# Altium schematic sheet Sheet_1_2024-04-10.schdoc
size 400 x 268 mm
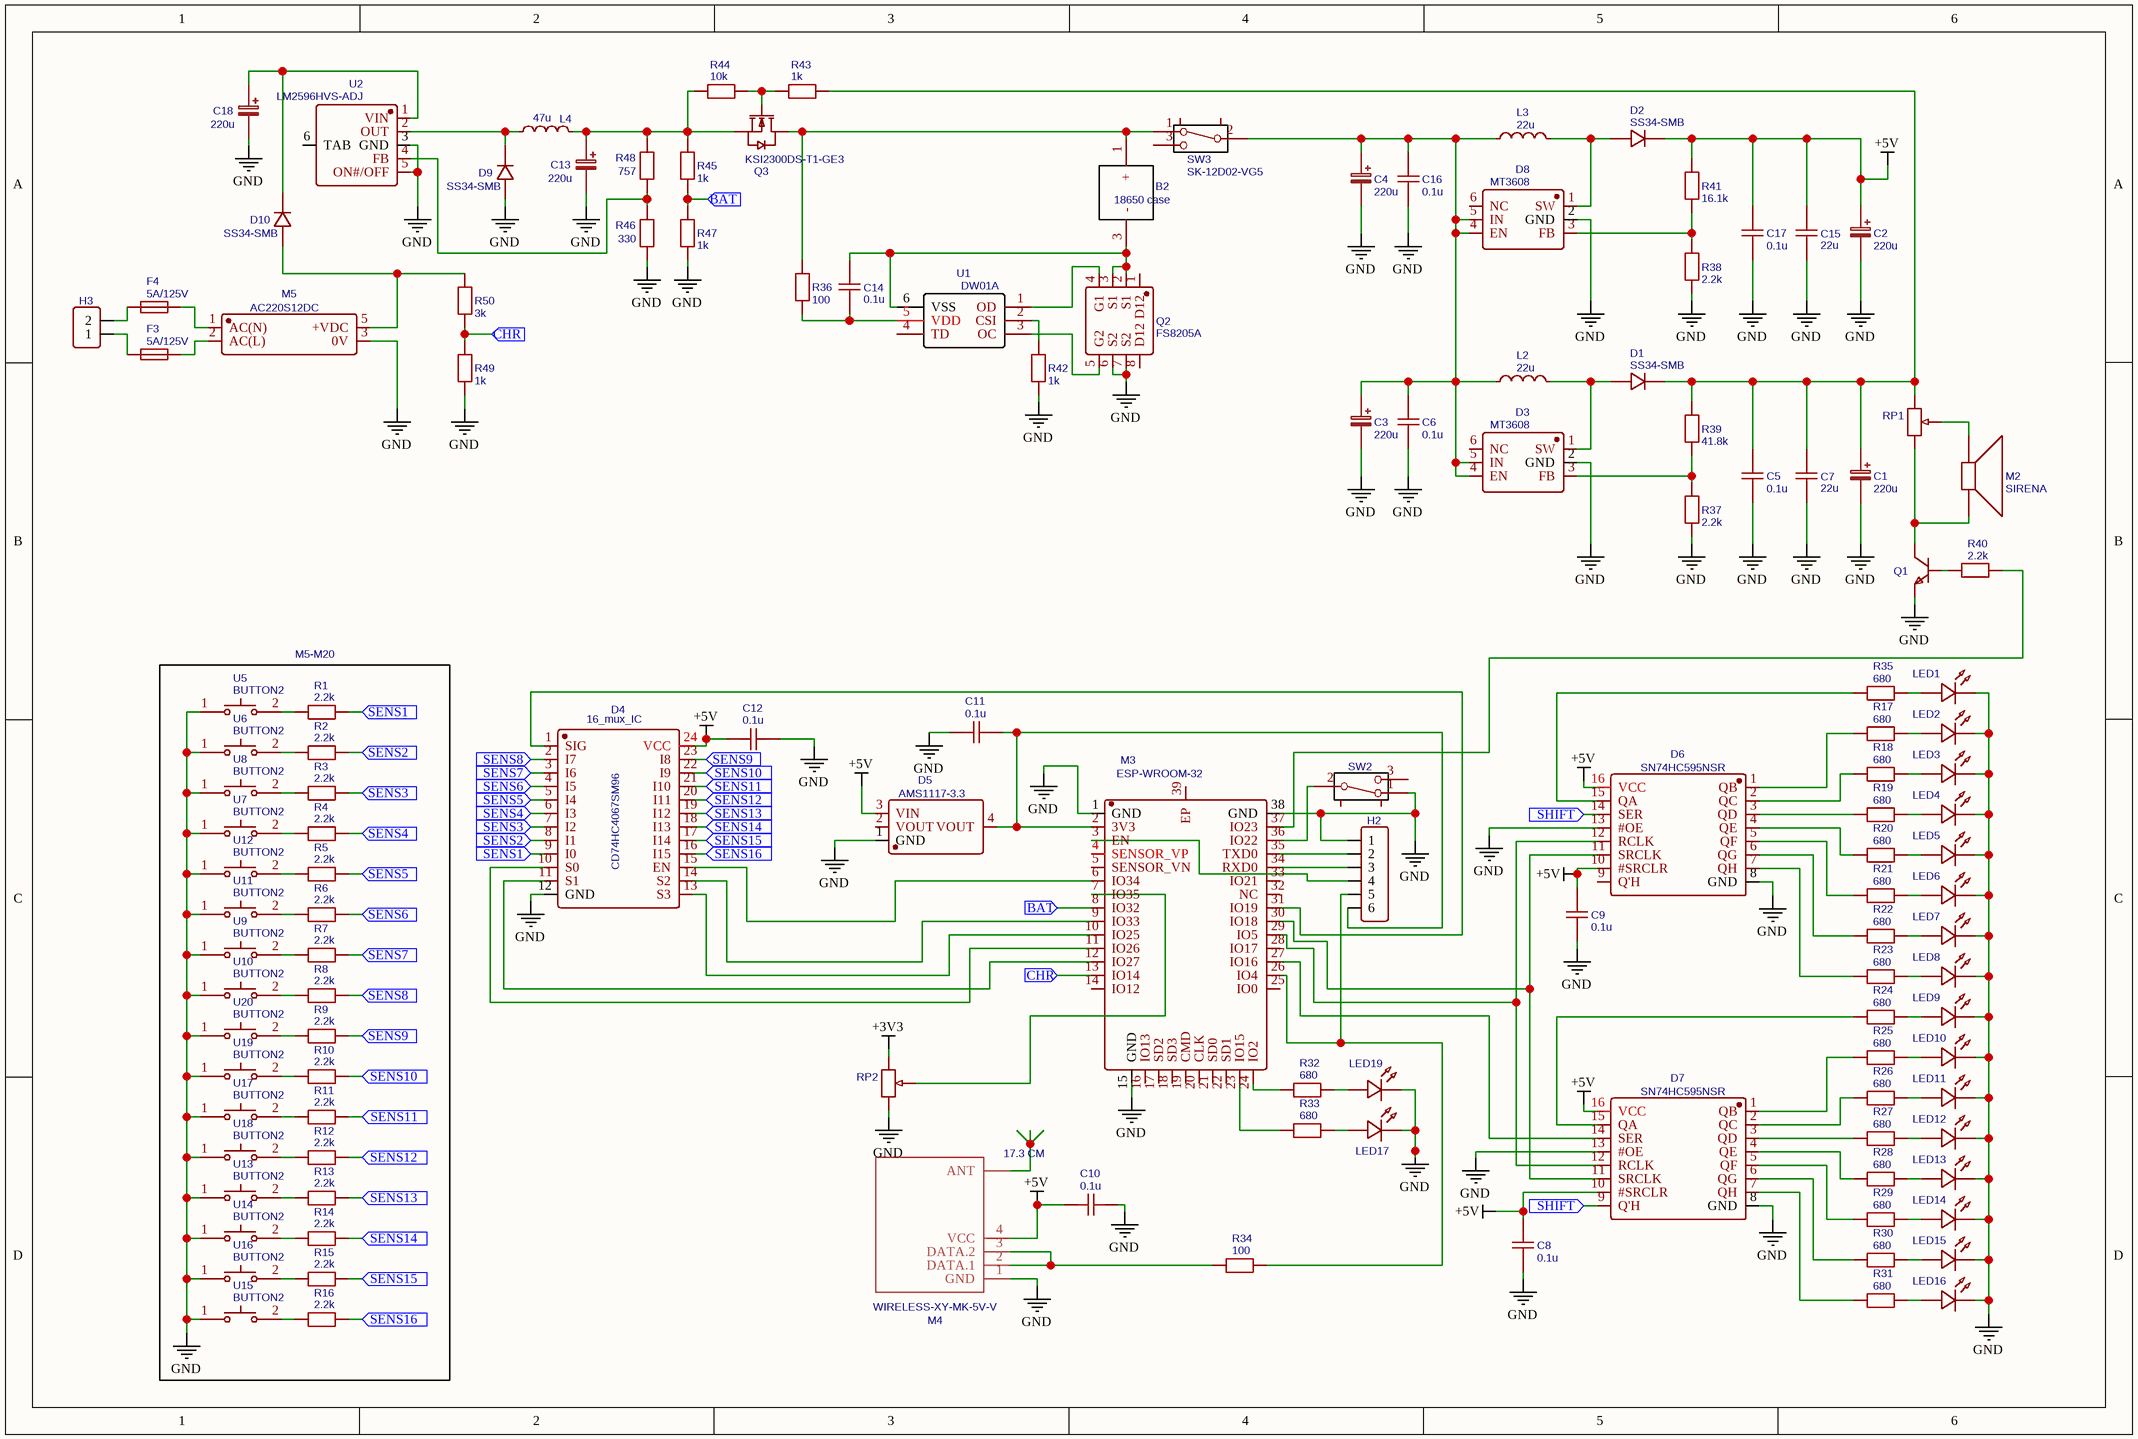
[diagram p0: Sheet_1_2024-04-10.schdoc]

## Parts
B2  18650 case  [MY-18650-02_18650]
C1  220u  [CAP-D8.0×H10.5]
C2  220u  [CAP-D8.0×H10.5]
C3  220u  [CAP-D8.0×H10.5]
C4  220u  [CAP-D8.0×H10.5]
C5  0.1u  [C0603]
C6  0.1u  [C0603]
C7  22u  [C0603]
C8  0.1u  [C0603]
C9  0.1u  [C0603]
C10  0.1u  [C0603]
C11  0.1u  [C0603]
C12  0.1u  [C0603]
C13  220u  [CAP-D8.0×H10.5]
C14  0.1u  [C0603]
C15  22u  [C0603]
C16  0.1u  [C0603]
C17  0.1u  [C0603]
C18  220u  [CAP-D8.0×H10.5]
D1  SS34-SMB  [SMB_L4.4-W3.6-LS5.3-RD]
D2  SS34-SMB  [SMB_L4.4-W3.6-LS5.3-RD]
D3  MT3608  [SOT-23-6_L2.9-W1.6-P0.95-LS2.8-BL]
D4  16_mux_IC  [HP4067]
D5  AMS1117-3.3  [SOT-223-3_L6.5-W3.4-P2.30-LS7.0-BR]
D6  SN74HC595NSR  [SOP-16_L10.3-W5.4-P1.27-LS7.8-BL]
D7  SN74HC595NSR  [SOP-16_L10.3-W5.4-P1.27-LS7.8-BL]
D8  MT3608  [SOT-23-6_L2.9-W1.6-P0.95-LS2.8-BL]
D9  SS34-SMB  [SMB_L4.4-W3.6-LS5.3-RD]
D10  SS34-SMB  [SMB_L4.4-W3.6-LS5.3-RD]
F3  5A/125V  [FUSE-SMD_L6.1-W2.5]
F4  5A/125V  [FUSE-SMD_L6.1-W2.5]
H2  HDR-F-2.54_1x6  [HDR-F-2.54_1X6]  (value not drawn)
H3  HDR-F-2.54_1x2  [HDR-F-2.54_1X2]  (value not drawn)
L2  22u  [L_AXIAL-0.6]
L3  22u  [L_AXIAL-0.6]
L4  47u  [L_AXIAL-0.6]
LED1  LED-TH-5mm_R  [LED-TH_BD5.0_RED]  (value not drawn)
LED2  LED-TH-5mm_R  [LED-TH_BD5.0_RED]  (value not drawn)
LED3  LED-TH-5mm_R  [LED-TH_BD5.0_RED]  (value not drawn)
LED4  LED-TH-5mm_R  [LED-TH_BD5.0_RED]  (value not drawn)
LED5  LED-TH-5mm_R  [LED-TH_BD5.0_RED]  (value not drawn)
LED6  LED-TH-5mm_R  [LED-TH_BD5.0_RED]  (value not drawn)
LED7  LED-TH-5mm_R  [LED-TH_BD5.0_RED]  (value not drawn)
LED8  LED-TH-5mm_R  [LED-TH_BD5.0_RED]  (value not drawn)
LED9  LED-TH-5mm_R  [LED-TH_BD5.0_RED]  (value not drawn)
LED10  LED-TH-5mm_R  [LED-TH_BD5.0_RED]  (value not drawn)
LED11  LED-TH-5mm_R  [LED-TH_BD5.0_RED]  (value not drawn)
LED12  LED-TH-5mm_R  [LED-TH_BD5.0_RED]  (value not drawn)
LED13  LED-TH-5mm_R  [LED-TH_BD5.0_RED]  (value not drawn)
LED14  LED-TH-5mm_R  [LED-TH_BD5.0_RED]  (value not drawn)
LED15  LED-TH-5mm_R  [LED-TH_BD5.0_RED]  (value not drawn)
LED16  LED-TH-5mm_R  [LED-TH_BD5.0_RED]  (value not drawn)
LED17  LED-TH-5mm_G  [LED-TH_BD5.0_GREEN]  (value not drawn)
LED19  LED-TH-5mm_B  [LED-TH_BD5.0_BLUE]  (value not drawn)
M2  SIRENA  [CONN-TH_2P-P5.08]
M3  ESP-WROOM-32  [WIFIM-SMD_ESP-WROOM-32]
M4  WIRELESS-XY-MK-5V-V  [WIRELESS-XY-MK-5V#V]
M5  AC220S12DC  [PWRM-TH_AC220S12DC]
Q1  2N3904(SOT-23)  [SOT-23-3_L2.9-W1.3-P1.90-LS2.4-TR]  (value not drawn)
Q2  FS8205A  [TSSOP-8_L4.4-W3.0-P0.65-LS6.4-BL-2]
Q3  KSI2300DS-T1-GE3  [SOT-23-3_L2.9-W1.3-P1.90-LS2.4-BR]
R1  2.2k  [R_AXIAL-0.8]
R2  2.2k  [R_AXIAL-0.8]
R3  2.2k  [R_AXIAL-0.8]
R4  2.2k  [R_AXIAL-0.8]
R5  2.2k  [R_AXIAL-0.8]
R6  2.2k  [R_AXIAL-0.8]
R7  2.2k  [R_AXIAL-0.8]
R8  2.2k  [R_AXIAL-0.8]
R9  2.2k  [R_AXIAL-0.8]
R10  2.2k  [R_AXIAL-0.8]
R11  2.2k  [R_AXIAL-0.8]
R12  2.2k  [R_AXIAL-0.8]
R13  2.2k  [R_AXIAL-0.8]
R14  2.2k  [R_AXIAL-0.8]
R15  2.2k  [R_AXIAL-0.8]
R16  2.2k  [R_AXIAL-0.8]
R17  680  [R1206]
R18  680  [R1206]
R19  680  [R1206]
R20  680  [R1206]
R21  680  [R1206]
R22  680  [R1206]
R23  680  [R1206]
R24  680  [R1206]
R25  680  [R1206]
R26  680  [R1206]
R27  680  [R1206]
R28  680  [R1206]
R29  680  [R1206]
R30  680  [R1206]
R31  680  [R1206]
R32  680  [R1206]
R33  680  [R1206]
R34  100  [R1206]
R35  680  [R1206]
R36  100  [R1206]
R37  2.2k  [R1206]
R38  2.2k  [R1206]
R39  41.8k  [R1206]
R40  2.2k  [R1206]
R41  16.1k  [R1206]
R42  1k  [R1206]
R43  1k  [R1206]
R44  10k  [R1206]
R45  1k  [R1206]
R46  330  [R1206]
R47  1k  [R1206]
R48  757  [R1206]
R49  1k  [R1206]
R50  3k  [R1206]
RP1  R_3386P_EU  [RES-ADJ-TH_3386P]  (value not drawn)
RP2  R_3386P_EU  [RES-ADJ-TH_3386P]  (value not drawn)
SW2  SK-12D02-VG5  [SW-TH_SK-12D02VG3]  (value not drawn)
SW3  SK-12D02-VG5  [SW-TH_SK-12D02VG3]
U1  DW01A  [SOT-23-6_L2.9-W1.6-P0.95-LS2.8-BL]
U2  LM2596HVS-ADJ  [TO-263-5_L10.0-W8.4-P1.70-LS15.3-BR]
U5  BUTTON2  [SW-SMD_L6.0-W3.5-LS8.0-1]
U6  BUTTON2  [SW-SMD_L6.0-W3.5-LS8.0-1]
U7  BUTTON2  [SW-SMD_L6.0-W3.5-LS8.0-1]
U8  BUTTON2  [SW-SMD_L6.0-W3.5-LS8.0-1]
U9  BUTTON2  [SW-SMD_L6.0-W3.5-LS8.0-1]
U10  BUTTON2  [SW-SMD_L6.0-W3.5-LS8.0-1]
U11  BUTTON2  [SW-SMD_L6.0-W3.5-LS8.0-1]
U12  BUTTON2  [SW-SMD_L6.0-W3.5-LS8.0-1]
U13  BUTTON2  [SW-SMD_L6.0-W3.5-LS8.0-1]
U14  BUTTON2  [SW-SMD_L6.0-W3.5-LS8.0-1]
U15  BUTTON2  [SW-SMD_L6.0-W3.5-LS8.0-1]
U16  BUTTON2  [SW-SMD_L6.0-W3.5-LS8.0-1]
U17  BUTTON2  [SW-SMD_L6.0-W3.5-LS8.0-1]
U18  BUTTON2  [SW-SMD_L6.0-W3.5-LS8.0-1]
U19  BUTTON2  [SW-SMD_L6.0-W3.5-LS8.0-1]
U20  BUTTON2  [SW-SMD_L6.0-W3.5-LS8.0-1]

## Blocks framed on the sheet
M5-M20: R1-R16 U5-U20

## Ports
BAT (in), CHR (in), SENS1 (in), SENS2 (in), SENS3 (in), SENS4 (in), SENS5 (in), SENS6 (in), SENS7 (in), SENS8 (in), SENS9 (in), SENS10 (in), SENS11 (in), SENS12 (in), SENS13 (in), SENS14 (in), SENS15 (in), SENS16 (in), SHIFT (in)

## Nets
+3V3: RP2.1
+5V: C2.1 C8.2 C9.2 C10.2 C12.2 C15.1 C17.2 D2.1(C) D4.24(VCC) D5.3(VIN) D6.10(#SRCLR) D6.16(VCC) D7.10(#SRCLR) D7.16(VCC) M4.4(VCC) R41.2
GND: C1.2 C2.2 C3.2 C4.2 C5.1 C6.1 C7.2 C8.1 C9.1 C10.1 C11.2 C12.1 C13.2 C15.2 C16.1 C17.1 C18.2 D3.2(GND) D4.12(GND) D5.1(GND) D6.8(GND) D6.13(#OE) D7.8(GND) D7.13(#OE) D8.2(GND) D9.2(A) H2.1 LED1.2 LED2.2 LED3.2 LED4.2 LED5.2 LED6.2 LED7.2 LED8.2 LED9.2 LED10.2 LED11.2 LED12.2 LED13.2 LED14.2 LED15.2 LED16.2 LED17.2 LED19.2 M3.1(GND) M3.15(GND) M3.38(GND) M4.1(GND) M5.3(0V) Q1.1(E) Q2.6(S2) Q2.7(S2) R37.1 R38.1 R42.1 R46.2 R47.2 R49.2 RP2.3 SW2.1 U2.3(GND) U2.5(ON#/OFF) U5.1 U6.1 U7.1 U8.1 U9.1 U10.1 U11.1 U12.1 U13.1 U14.1 U15.1 U16.1 U17.1 U18.1 U19.1 U20.1
BAT: M3.8(IO32) R45.2 R47.1 ; port BAT
CHR: M3.13(IO14) R49.1 R50.2 ; port CHR
SENS1: D4.9(I0) R1.2 ; port SENS1
SENS2: D4.8(I1) R2.2 ; port SENS2
SENS3: D4.7(I2) R3.2 ; port SENS3
SENS4: D4.6(I3) R4.2 ; port SENS4
SENS5: D4.5(I4) R5.2 ; port SENS5
SENS6: D4.4(I5) R6.2 ; port SENS6
SENS7: D4.3(I6) R7.2 ; port SENS7
SENS8: D4.2(I7) R8.2 ; port SENS8
SENS9: D4.23(I8) R9.2 ; port SENS9
SENS10: D4.22(I9) R10.2 ; port SENS10
SENS11: D4.21(I10) R11.2 ; port SENS11
SENS12: D4.20(I11) R12.2 ; port SENS12
SENS13: D4.19(I12) R13.2 ; port SENS13
SENS14: D4.18(I13) R14.2 ; port SENS14
SENS15: D4.17(I14) R15.2 ; port SENS15
SENS16: D4.16(I15) R16.2 ; port SENS16
SHIFT: D6.14(SER) D7.9(Q'H) ; port SHIFT
NetB2_1: B2.1(+) Q3.3(D) R36.2 SW3.1
NetB2_3: B2.3(-) C14.1 Q2.2(S1) Q2.3(S1) U1.6(VSS)
NetC1_1: C1.1 C5.2 C7.1 D1.1(C) R39.2 R43.1 RP1.1
NetC3_1: C3.1 C4.1 C6.2 C16.2 D3.4(EN) D3.5(IN) D8.4(EN) D8.5(IN) L2.1 L3.1 SW3.2
NetC11_1: C11.1 D5.4(VOUT) H2.6 M3.2(3V3)
NetC13_1: C13.1 L4.1 Q3.2(S) R44.2 R45.1 R48.1
NetC14_2: C14.2 R36.1 U1.5(VDD)
NetC18_1: C18.1 D10.1(C) U2.1(VIN)
NetD1_2: D1.2(A) D3.1(SW) L2.2
NetD2_2: D2.2(A) D8.1(SW) L3.2
NetD3_3: D3.3(FB) R37.2 R39.1
NetD4_1: D4.1(SIG) M3.31(IO19)
NetD4_10: D4.10(S0) M3.11(IO26)
NetD4_11: D4.11(S1) M3.12(IO27)
NetD4_13: D4.13(S3) M3.10(IO25)
NetD4_14: D4.14(S2) M3.9(IO33)
NetD4_15: D4.15(EN) M3.6(IO34)
NetD6_1: D6.1(QB) R17.1
NetD6_2: D6.2(QC) R18.1
NetD6_3: D6.3(QD) R19.1
NetD6_4: D6.4(QE) R20.1
NetD6_5: D6.5(QF) R21.1
NetD6_6: D6.6(QG) R22.1
NetD6_7: D6.7(QH) R23.1
NetD6_11: D6.11(SRCLK) D7.11(SRCLK) M3.30(IO18)
NetD6_12: D6.12(RCLK) D7.12(RCLK) M3.29(IO5)
NetD6_15: D6.15(QA) R35.1
NetD7_1: D7.1(QB) R25.1
NetD7_2: D7.2(QC) R26.1
NetD7_3: D7.3(QD) R27.1
NetD7_4: D7.4(QE) R28.1
NetD7_5: D7.5(QF) R29.1
NetD7_6: D7.6(QG) R30.1
NetD7_7: D7.7(QH) R31.1
NetD7_14: D7.14(SER) M3.27(IO16)
NetD7_15: D7.15(QA) R24.1
NetD8_3: D8.3(FB) R38.2 R41.1
NetD9_1: D9.1(C) L4.2 U2.2(OUT)
NetD10_2: D10.2(A) M5.5(+VDC) R50.1
NetF3_1: F3.1 H3.1
NetF3_2: F3.2 M5.2(AC(L))
NetF4_1: F4.1 H3.2
NetF4_2: F4.2 M5.1(AC(N))
NetH2_2: H2.2 M3.35(TXD0)
NetH2_3: H2.3 M3.34(RXD0)
NetH2_4: H2.4 M3.3(EN)
NetH2_5: H2.5 M3.26(IO4) R34.2
NetLED1_1: LED1.1 R35.2
NetLED2_1: LED2.1 R17.2
NetLED3_1: LED3.1 R18.2
NetLED4_1: LED4.1 R19.2
NetLED5_1: LED5.1 R20.2
NetLED6_1: LED6.1 R21.2
NetLED7_1: LED7.1 R22.2
NetLED8_1: LED8.1 R23.2
NetLED9_1: LED9.1 R24.2
NetLED10_1: LED10.1 R25.2
NetLED11_1: LED11.1 R26.2
NetLED12_1: LED12.1 R27.2
NetLED13_1: LED13.1 R28.2
NetLED14_1: LED14.1 R29.2
NetLED15_1: LED15.1 R30.2
NetLED16_1: LED16.1 R31.2
NetLED17_1: LED17.1 R33.2
NetLED19_1: LED19.1 R32.2
NetM2_1: M2.1 RP1.2
NetM2_2: M2.2 Q1.3(C) RP1.3
NetM3_7: M3.7(IO35) RP2.2
NetM3_23: M3.23(IO15) R33.1
NetM3_24: M3.24(IO2) R32.1
NetM3_36: M3.36(IO22) SW2.2
NetM3_37: M3.37(IO23) R40.2
NetM4_2: M4.2(DATA.1) M4.3(DATA.2) R34.1
NetQ1_2: Q1.2(B) R40.1
NetQ2_4: Q2.4(G1) U1.1(OD)
NetQ2_5: Q2.5(G2) U1.3(OC)
NetQ3_1: Q3.1(G) R43.2 R44.1
NetR1_1: R1.1 U5.2
NetR2_1: R2.1 U6.2
NetR3_1: R3.1 U8.2
NetR4_1: R4.1 U7.2
NetR5_1: R5.1 U12.2
NetR6_1: R6.1 U11.2
NetR7_1: R7.1 U9.2
NetR8_1: R8.1 U10.2
NetR9_1: R9.1 U20.2
NetR10_1: R10.1 U19.2
NetR11_1: R11.1 U17.2
NetR12_1: R12.1 U18.2
NetR13_1: R13.1 U13.2
NetR14_1: R14.1 U14.2
NetR15_1: R15.1 U16.2
NetR16_1: R16.1 U15.2
NetR42_2: R42.2 U1.2(CSI)
NetR46_1: R46.1 R48.2 U2.4(FB)

Not connected (* = marked no-connect by the designer): D3 6(NC); D5 2(VOUT); D6 9(Q'H); D8 6(NC); M3 4(SENSOR_VP) 5(SENSOR_VN) 14(IO12) 16(IO13) 17(SD2) 18(SD3) 19(CMD) 20(CLK) 21(SD0) 22(SD1) 25(IO0) 28(IO17) 32(NC) 33(IO21) 39(EP); M4 ANT; Q2 1(D12) 8(D12); SW2 3 4 5; SW3 3 4 5; U1 4(TD); U2 6(TAB)

## Notes on the sheet
- (near M4) 17.3 CM
- (in symbol 16_mux_IC) CD74HC4067SM96

## Library data of the parts
B2 = 18650 case: Contributor: s.a.timofeev93; spicePre: U; spiceSymbolName: 18650 case
C1-C4 C13 C18 = 220u: nameAlias: Value(F); Contributor: LCEDA_Lib; spicePre: C; spiceSymbolName: CE_SMD_D8.0×H10.5_EU
C5 C6 C8-C12 C14 C16 C17 = 0.1u: nameAlias: Value(F); Contributor: LCEDA_Lib; spicePre: C; spiceSymbolName: C_0603_US
C7 C15 = 22u: nameAlias: Value(F); Contributor: LCEDA_Lib; spicePre: C; spiceSymbolName: C_0603_US
D1 D2 D9 D10 = SS34-SMB: Manufacturer: GOODWORK(固得沃克); Contributor: LCSC; Supplier: LCSC; Supplier Part: C908684; Manufacturer Part: SS34-SMB; JLCPCB Part Class: Extended Part; link: https://lcsc.com/eda_search?q=C908684&%26type=1&ref=editor; spicePre: D; spiceSymbolName: SS34-SMB
D3 D8 = MT3608: Manufacturer: 西安航天民芯; Supplier: LCSC; Manufacturer Part: MT3608; Supplier Part: C84817; JLCPCB Part Class: Extended Part; link: https://lcsc.com/eda_search?q=C84817&%26type=1&ref=editor; spicePre: U; spiceSymbolName: MT3608
D4 = 16_mux_IC: Contributor: Jogiraju; spicePre: U; spiceSymbolName: 16_mux_IC
D5 = AMS1117-3.3: Manufacturer: AMS; sourceId: dwIGgezVh; timeStamp: 1476261164; Supplier: LCSC; Manufacturer Part: AMS1117-3.3; Supplier Part: C6186; JLCPCB Part Class: Basic Part; link: https://lcsc.com/eda_search?q=C6186&%26type=1&ref=editor; spicePre: U; spiceSymbolName: AMS1117-3.3
D6 D7 = SN74HC595NSR: Manufacturer: TI(德州仪器); Contributor: LCSC; Supplier: LCSC; Supplier Part: C191873; Manufacturer Part: SN74HC595NSR; JLCPCB Part Class: Extended Part; spicePre: U; spiceSymbolName: SN74HC595NSR
F3 F4 = 5A/125V: Manufacturer: null; Contributor: lcsc; Supplier: LCSC; Supplier Part: C9900024401; Manufacturer Part: 5A/125V; JLCPCB Part Class: Extended Part; link: https://lcsc.com/eda_search?q=C9900024401&%26type=1&ref=editor; spicePre: U; spiceSymbolName: 5A/125V
H2 = HDR-F-2.54_1x6: Contributor: LCEDA_Lib; Supplier Part: C40877; Supplier: LCSC; spicePre: H; spiceSymbolName: HDR-F-2.54_1x6
H3 = HDR-F-2.54_1x2: Contributor: LCEDA_Lib; Supplier Part: C49661; Supplier: LCSC; spicePre: H; spiceSymbolName: HDR-F-2.54_1x2
L2 L3 = 22u: nameAlias: Value(H); Contributor: LCEDA_Lib; spicePre: L; spiceSymbolName: L_AXIAL-0.6_US
L4 = 47u: nameAlias: Value(H); Contributor: LCEDA_Lib; spicePre: L; spiceSymbolName: L_AXIAL-0.6_US
LED1-LED16 = LED-TH-5mm_R: Manufacturer: EVERLIGHT(台湾亿光); Manufacturer Part: 333-2SURD/S530-A3; Contributor: LCEDA_Lib; Supplier Part: C87271; Supplier: LCSC; spicePre: L; spiceSymbolName: LED-TH-5mm_R
LED17 = LED-TH-5mm_G: Manufacturer: EVERLIGHT(台湾亿光); Manufacturer Part: 333-2SYGD/S530-E2; Contributor: LCEDA_Lib; Supplier Part: C88163; Supplier: LCSC; spicePre: L; spiceSymbolName: LED-TH-5mm_G
LED19 = LED-TH-5mm_B: Contributor: LCEDA_Lib; Supplier: LCSC; spicePre: L; spiceSymbolName: LED-TH-5mm_B
M2 = SIRENA: Contributor: albertocruz; spicePre: U; spiceSymbolName: SIRENA SIMBOL
M3 = ESP-WROOM-32: Manufacturer: ESPRESSIF(乐鑫); Manufacturer Part: ESP32-WROOM-32; Supplier: LCSC; Supplier Part: C95209; JLCPCB Part Class: Extended Part; link: https://lcsc.com/eda_search?q=C95209&%26type=1&ref=editor; spicePre: U; spiceSymbolName: ESP-WROOM-32
M4 = WIRELESS-XY-MK-5V-V: Contributor: Krzysztof; spicePre: M; spiceSymbolName: WIRELESS-XY-MK-5V-V
M5 = AC220S12DC: Manufacturer: HenLv(恒率); Manufacturer Part: AC220S12DC-3W; Contributor: LCSC; Supplier: LCSC; Supplier Part: C348883; JLCPCB Part Class: Extended Part; link: https://lcsc.com/eda_search?q=C348883&%26type=1&ref=editor; spicePre: U; spiceSymbolName: AC220S12DC-3W_C348883
Q1 = 2N3904(SOT-23): Manufacturer: KEC; Manufacturer Part: 2n3904S-RTK/PS; Contributor: LCEDA_Lib; Supplier: LCSC; Supplier Part: C18536; Paste Type: SOT-23; spicePre: Q; spiceSymbolName: 2N3904(SOT-23)
Q2 = FS8205A: Manufacturer: FORTUNE(富晶); Supplier: LCSC; Manufacturer Part: FS8205A; Supplier Part: C16052; JLCPCB Part Class: Extended Part; link: https://lcsc.com/eda_search?q=C16052&%26type=1&ref=editor; spicePre: Q; spiceSymbolName: FS8205A
Q3 = KSI2300DS-T1-GE3: Manufacturer: KUU; Contributor: LCSC; Supplier: LCSC; Supplier Part: C2891684; Manufacturer Part: KSI2300DS-T1-GE3; JLCPCB Part Class: Extended Part; spicePre: Q; spiceSymbolName: KSI2300DS-T1-GE3
R1-R16 R37 R38 R40 = 2.2k: nameAlias: Value(Ω); Contributor: LCEDA_Lib; spicePre: R
  R1-R16: spiceSymbolName: R_AXIAL-0.8_EU
  R37 R38 R40: spiceSymbolName: R_1206_EU
R17-R33 R35 = 680: nameAlias: Value(Ω); Contributor: LCEDA_Lib; spicePre: R; spiceSymbolName: R_1206_EU
R34 R36 = 100: nameAlias: Value(Ω); Contributor: LCEDA_Lib; spicePre: R; spiceSymbolName: R_1206_EU
R39 = 41.8k: nameAlias: Value(Ω); Contributor: LCEDA_Lib; spicePre: R; spiceSymbolName: R_1206_EU
R41 = 16.1k: nameAlias: Value(Ω); Contributor: LCEDA_Lib; spicePre: R; spiceSymbolName: R_1206_EU
R42 R43 R45 R47 R49 = 1k: nameAlias: Value(Ω); Contributor: LCEDA_Lib; spicePre: R; spiceSymbolName: R_1206_EU
R44 = 10k: nameAlias: Value(Ω); Contributor: LCEDA_Lib; spicePre: R; spiceSymbolName: R_1206_EU
R46 = 330: nameAlias: Value(Ω); Contributor: LCEDA_Lib; spicePre: R; spiceSymbolName: R_1206_EU
R48 = 757: nameAlias: Value(Ω); Contributor: LCEDA_Lib; spicePre: R; spiceSymbolName: R_1206_EU
R50 = 3k: nameAlias: Value(Ω); Contributor: LCEDA_Lib; spicePre: R; spiceSymbolName: R_1206_EU
RP1 RP2 = R_3386P_EU: nameAlias: Resistance (Ohms); Contributor: LCEDA_Lib; Value(Ω): 10K; Supplier: LCSC; spicePre: R; spiceSymbolName: R_3386P_EU
SW2 SW3 = SK-12D02-VG5: Manufacturer: Rectangular Connectors - Contacts; Contributor: LCSC; Supplier: LCSC; Supplier Part: C136722; Manufacturer Part: SK-12D02-VG5; spicePre: S; spiceSymbolName: SK-12D02-VG5
U1 = DW01A: Manufacturer: null; Supplier: LCSC; Manufacturer Part: DW01A; Supplier Part: C85680; JLCPCB Part Class: Extended Part; link: https://lcsc.com/eda_search?q=C85680&%26type=1&ref=editor; spicePre: U; spiceSymbolName: DW01A
U2 = LM2596HVS-ADJ: Manufacturer: UMW(友台半导体); Contributor: LCSC; Supplier: LCSC; Supplier Part: C347447; Manufacturer Part: LM2596HVS-ADJ; JLCPCB Part Class: Extended Part; link: https://lcsc.com/eda_search?q=C347447&%26type=1&ref=editor; spicePre: U; spiceSymbolName: LM2596HVS-ADJ
U5-U20 = BUTTON2: Manufacturer: null; Contributor: LCSC; Supplier: LCSC; Supplier Part: C9900005988; Manufacturer Part: BUTTON2; JLCPCB Part Class: Extended Part; spicePre: U; spiceSymbolName: BUTTON2